# EAGLE design clcd_serial (EAGLE 5.02)
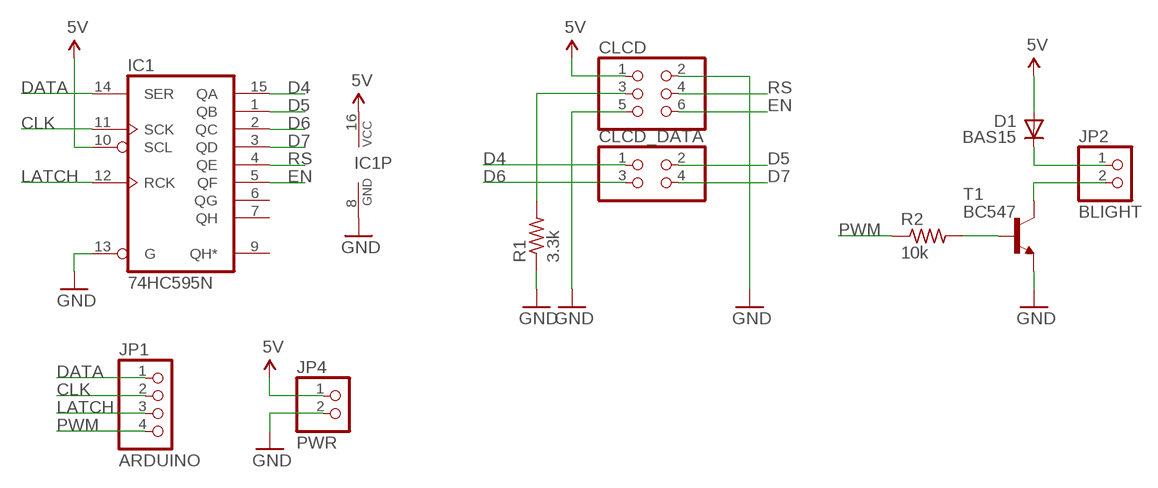
[diagram p0: schematic, sheet 1]

## Parts
CLCD  PINHD-2X3  [2X03]
CLCD_DATA  PINHD-2X2  [2X02]
D1  BAS15  [DO34-7]
IC1  74HC595N  [DIL16]
JP1  ARDUINO  PINHD-1X4  [1X04]
JP2  BLIGHT  PINHD-1X2  [1X02]
JP4  PWR  PINHD-1X2  [1X02]
R1  3.3k  R-US_0207/7  [0207/7]
R2  10k  R-US_0207/7  [0207/7]
T1  BC547  [TO92]

## Nets
5V: CLCD.1 D1.A IC1.10(SCL) IC1.16(VCC) JP4.1
CLK: IC1.11(SCK) JP1.2
D4: CLCD_DATA.1 IC1.15(QA)
D5: CLCD_DATA.2 IC1.1(QB)
D6: CLCD_DATA.3 IC1.2(QC)
D7: CLCD_DATA.4 IC1.3(QD)
DATA: IC1.14(SER) JP1.1
EN: CLCD.6 IC1.5(QF)
GND: CLCD.2 CLCD.5 IC1.8(GND) IC1.13(G) JP4.2 R1.1 T1.1(E)
LATCH: IC1.12(RCK) JP1.3
N$1: CLCD.3 R1.2
N$2: D1.C JP2.1
N$3: R2.2 T1.2(B)
N$5: JP2.2 T1.3(C)
PWM: JP1.4 R2.1
RS: CLCD.4 IC1.4(QE)
Unconnected: IC1.6(QG) IC1.7(QH) IC1.9(QH*)

## Library data of the parts
CLCD = pinhead:PINHD-2X3: PIN HEADER
CLCD_DATA = pinhead:PINHD-2X2: PIN HEADER
D1 = diode:BAS15: DIODE high speed
IC1 = 74xx-eu:74*595: 8-bit SHIFT REGISTER, output latch
JP1 = pinhead:PINHD-1X4: PIN HEADER
JP2 JP4 = pinhead:PINHD-1X2: PIN HEADER
R1 R2 = resistor:R-US_: RESISTOR, American symbol
T1 = transistor:BC547: NPN TRANSISTOR

## Board
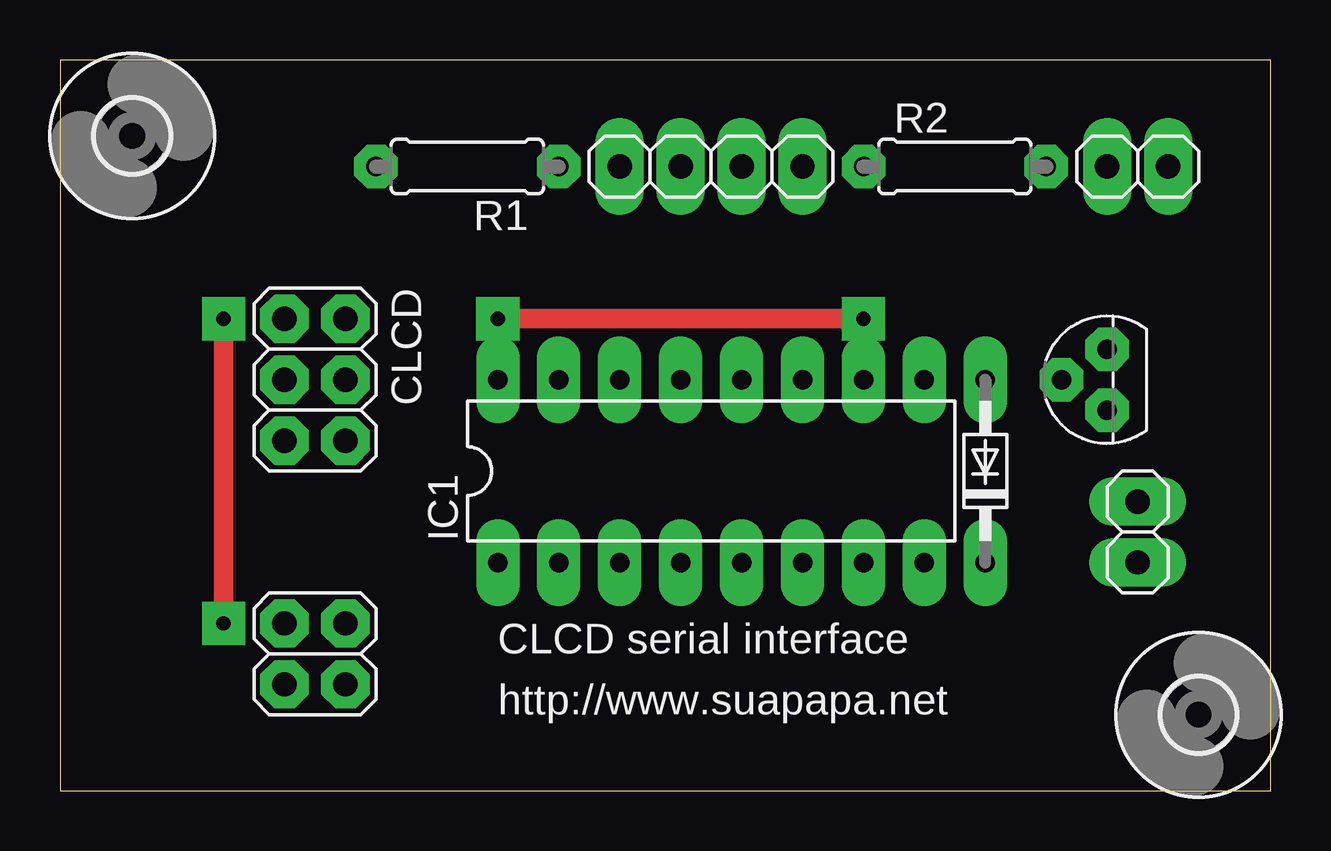
[diagram p1: board, top side]
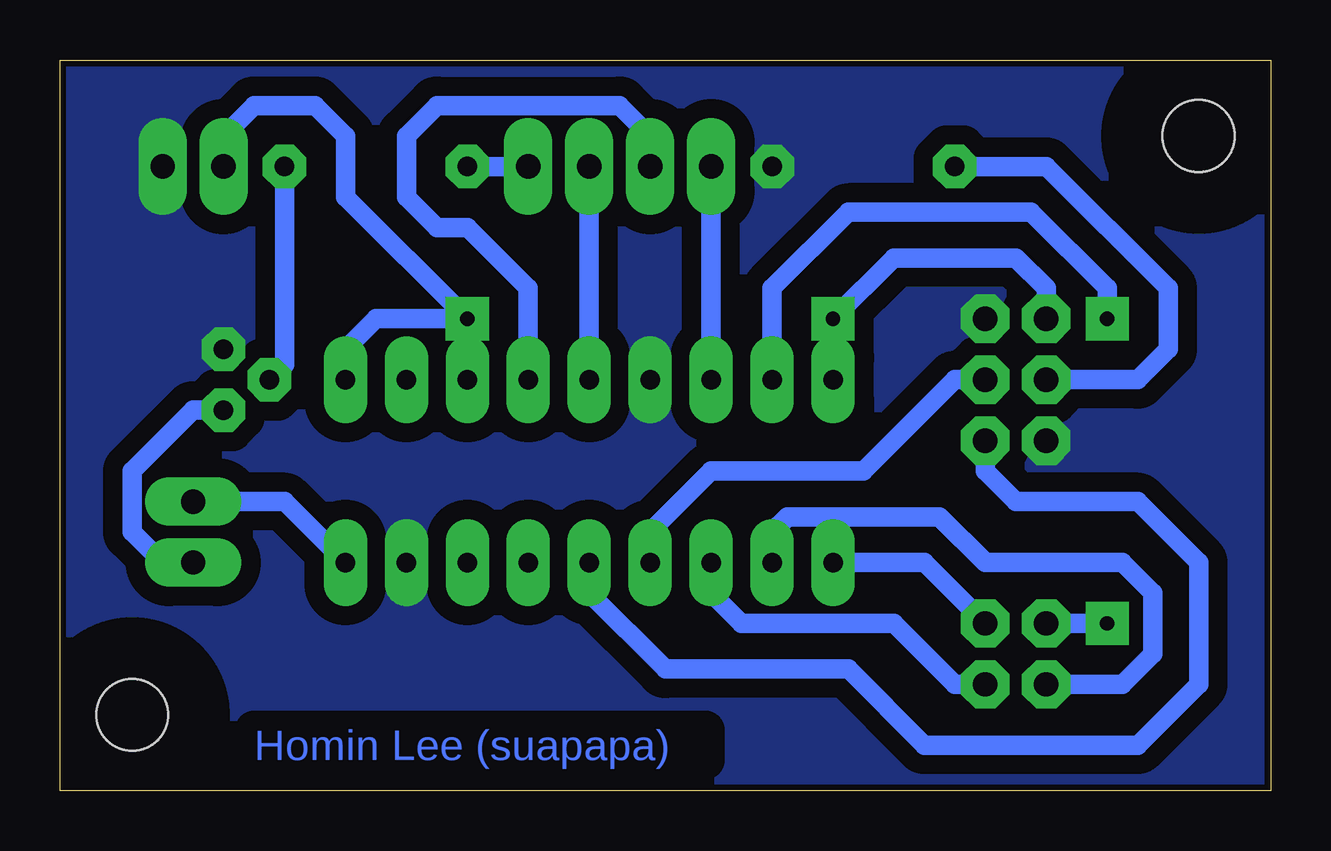
[diagram p2: board, bottom side, seen from below]

Size 50.47 x 30.47 mm. Coordinates in mm from the lower left corner, seen from the top.
Outline: 0,0 50.47,0 50.47,30.47 0,30.47 0,0
Copper layers (1*16): Top 0.035mm / dielectric 1.5mm / Bottom 0.035mm
Design rules "hobby *": minimum track width 0.8mm, minimum drill 0.8mm, track to track 0.8mm, track to pad 0.8mm, pad to pad 0.25mm, via to via 0.6mm, smd to smd 8mil, copper to edge 10mil, drill to drill 8mil, minimum pad ring 0.5mm, minimum via ring 0.6mm, stop-mask expansion 0mil, vias tented up to drill 0mil, thermal gap 10mil

### Footprints (pad centres in the part's own frame; a part is rotated, then mirrored left to right if it is on the bottom)
2X03 = drill 1.016 octagon: 1 -2.54,-1.27; 2 -2.54,1.27; 3 0,-1.27; 4 0,1.27; 5 2.54,-1.27; 6 2.54,1.27
2X02 = drill 1.016 octagon: 1 -1.27,-1.27; 2 -1.27,1.27; 3 1.27,-1.27; 4 1.27,1.27
DO34-7 = drill 0.813 long: A 3.81,0; C -3.81,0
DIL16 = drill 0.813 long: 1 -8.89,-3.81; 2 -6.35,-3.81; 3 -3.81,-3.81; 4 -1.27,-3.81; 5 1.27,-3.81; 6 3.81,-3.81; 7 6.35,-3.81; 8 8.89,-3.81; 9 8.89,3.81; 10 6.35,3.81; 11 3.81,3.81; 12 1.27,3.81; 13 -1.27,3.81; 14 -3.81,3.81; 15 -6.35,3.81; 16 -8.89,3.81
1X04 = drill 1.016 long: 1 -3.81,0; 2 -1.27,0; 3 1.27,0; 4 3.81,0
1X02 = drill 1.016 long: 1 -1.27,0; 2 1.27,0
0207/7 = drill 0.813 octagon: 1 -3.81,0; 2 3.81,0
TO92 = drill 0.813 octagon: 1 1.27,0; 2 0,1.905; 3 -1.27,0
3,0 = hole 3: 0,0

### Placement (x,y rotation side)
CLCD  10.63,17.14 270 top
CLCD_DATA  10.63,5.71 270 top
D1  38.57,13.33 90 top
IC1  27.14,13.33 0 top
JP1  27.14,26.03 0 top
JP2  44.92,10.79 270 top
JP4  44.92,26.03 0 top
R1  16.98,26.03 180 top
R2  37.3,26.03 0 top
T1  43.65,17.14 90 top
U$6  [3,0]  3.01,27.3 0 top
U$7  [3,0]  47.46,3.17 0 top

### Tracks (layer width: path | path; a pad name or v marks a point on that pad's centre or on a via)
5V  (via drill 0.6)
  Top 0.813: v18.25,19.68 v33.49,19.68
  Bottom 0.813: IC1.16 v18.25,19.68 15.71,22.22 10.63,22.22 9.36,20.95 CLCD.1 | JP4.1 43.65,27.3 42.38,28.57 39.84,28.57 38.57,27.3 38.57,24.76 v33.49,19.68 | v33.49,19.68 IC1.10 | v33.49,19.68 37.3,19.68 38.57,18.41 D1.A
CLK
  Bottom 0.813: JP1.2 25.87,27.3 27.14,28.57 34.76,28.57 36.03,27.3 36.03,24.76 34.76,23.49 33.49,23.49 30.95,20.95 IC1.11
D4  (via drill 0.6)
  Top 0.813: v6.82,6.98 v6.82,19.68
  Bottom 0.813: v6.82,6.98 CLCD_DATA.1 | v6.82,19.68 6.82,20.95 10,24.12 17.61,24.12 20.79,20.95 IC1.15
D5
  Bottom 0.813: IC1.1 14.44,9.52 CLCD_DATA.2
D6
  Bottom 0.813: CLCD_DATA.3 6.18,4.44 4.92,5.71 4.92,8.25 6.18,9.52 11.9,9.52 13.81,11.42 20.15,11.42 20.79,10.79 IC1.2
D7
  Bottom 0.813: CLCD_DATA.4 13.17,4.44 15.71,6.98 22.06,6.98 23.33,8.25 IC1.3
DATA
  Bottom 0.813: IC1.14 JP1.1
EN
  Bottom 0.813: CLCD.6 11.9,13.33 10.63,12.06 5.55,12.06 3.01,9.52 3.01,4.44 5.55,1.9 14.44,1.9 17.61,5.08 25.23,5.08 28.41,8.25 IC1.5
GND
  pour Bottom (no thermals): 0.47,31.11 51.27,31.11 51.27,-0.64 0.47,-0.64
LATCH
  Bottom 0.813: IC1.12 JP1.3
N$1
  Bottom 0.813: CLCD.3 5.55,17.14 4.28,18.41 4.28,20.95 9.36,26.03 R1.2
N$2
  Bottom 0.813: D1.C 41.11,12.06 JP2.1
N$3
  Bottom 0.813: T1.2 41.11,17.77 R2.2
N$5
  Bottom 0.813: T1.3 44.92,15.87 47.46,13.33 47.46,10.79 46.19,9.52 JP2.2
PWM
  Bottom 0.813: JP1.4 R2.1
RS
  Bottom 0.813: IC1.4 25.87,10.79 23.33,13.33 16.98,13.33 13.17,17.14 CLCD.4

### Text on the board
Bottom: Homin Lee (suapapa)
tNames: CLCD serial interface | http://www.suapapa.net
tValues: 5V | GND | DATA | CLK | LAT | PWM | A | K